# Altium schematic sheet qspi_flash.schdoc
size 209 x 297 mm; Scale: 1:1; DocumentType: Ñõåìà ýëåêòðè÷åñêàÿ ïðèíöèïèàëüíàÿ; FirstReferrence: ÀÁÂÃ.123456.001; Title1str: {Наименование}; PageSetup: Record=PageOptions¦CenterHorizontal=False¦CenterVertical=False¦PrintScale=0.95¦XCorrection=0.00¦YCorrection=0.00¦PrintKind=1¦BorderSize=5000000¦LeftOffset=0¦BottomOffset=0¦Orientation=1¦PaperLength=1000¦PaperWidth=1000¦Scale=100¦PaperSource=15¦PrintQuality=600¦MediaType=1¦DitherType=10¦PaperKind=A4¦PrintScaleMode=1; DocumentType1str: {Документ}; DocumentType2str: {Документ}
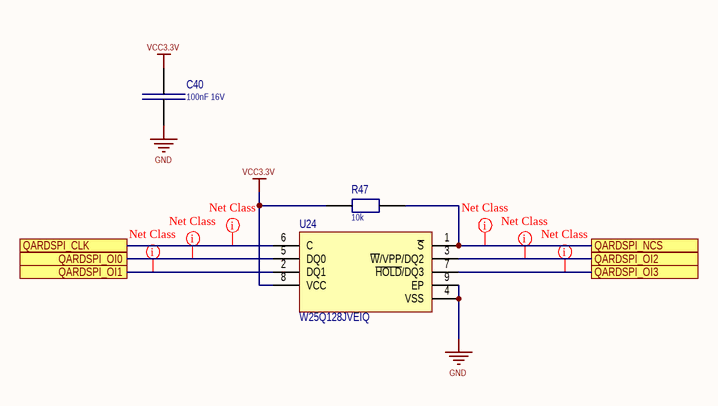
[diagram p0: qspi_flash.schdoc]

## Parts
C40  100nF 16V  [C_0603]
R47  10k  [R_0603]
U24  W25Q128JVEIQ  [W-PDFN-8 (MLP8) – 8mm ? 6mm  Se]

## Ports
QARDSPI_CLK, QARDSPI_NCS, QARDSPI_OI0, QARDSPI_OI1, QARDSPI_OI2, QARDSPI_OI3

## Nets
GND: C40.1 U24.4(VSS) U24.9(EP)
VCC3.3V: C40.2 R47.1 U24.8(VCC)
QARDSPI_CLK: U24.6(C) ; port QARDSPI_CLK
QARDSPI_NCS: R47.2 U24.1(~{S}) ; port QARDSPI_NCS
QARDSPI_OI0: U24.5(DQ0) ; port QARDSPI_OI0
QARDSPI_OI1: U24.2(DQ1) ; port QARDSPI_OI1
QARDSPI_OI2: U24.3(~{W}/VPP/DQ2) ; port QARDSPI_OI2
QARDSPI_OI3: U24.7(~{HOLD}/DQ3) ; port QARDSPI_OI3

## Layout directives
net class Undefined: QARDSPI_CLK, QARDSPI_NCS, QARDSPI_OI0, QARDSPI_OI1, QARDSPI_OI2, QARDSPI_OI3

## Library data of the parts
C40 = C0603: Capacitor; Part Number: CC0603KPX7R9BB104; Value: 100nF 16V
R47 = RES_SMD: Resistor; Part Number: RC0603FR-0710KL; Alternative Part: *; Value: 10k
U24 = MT25QL********W9-0SIT: Flash Memory; Part Number: W25Q128JVEIQ; Alternative Part: *